# Altium schematic sheet SteeringWheel_v2.SchDoc
size A4
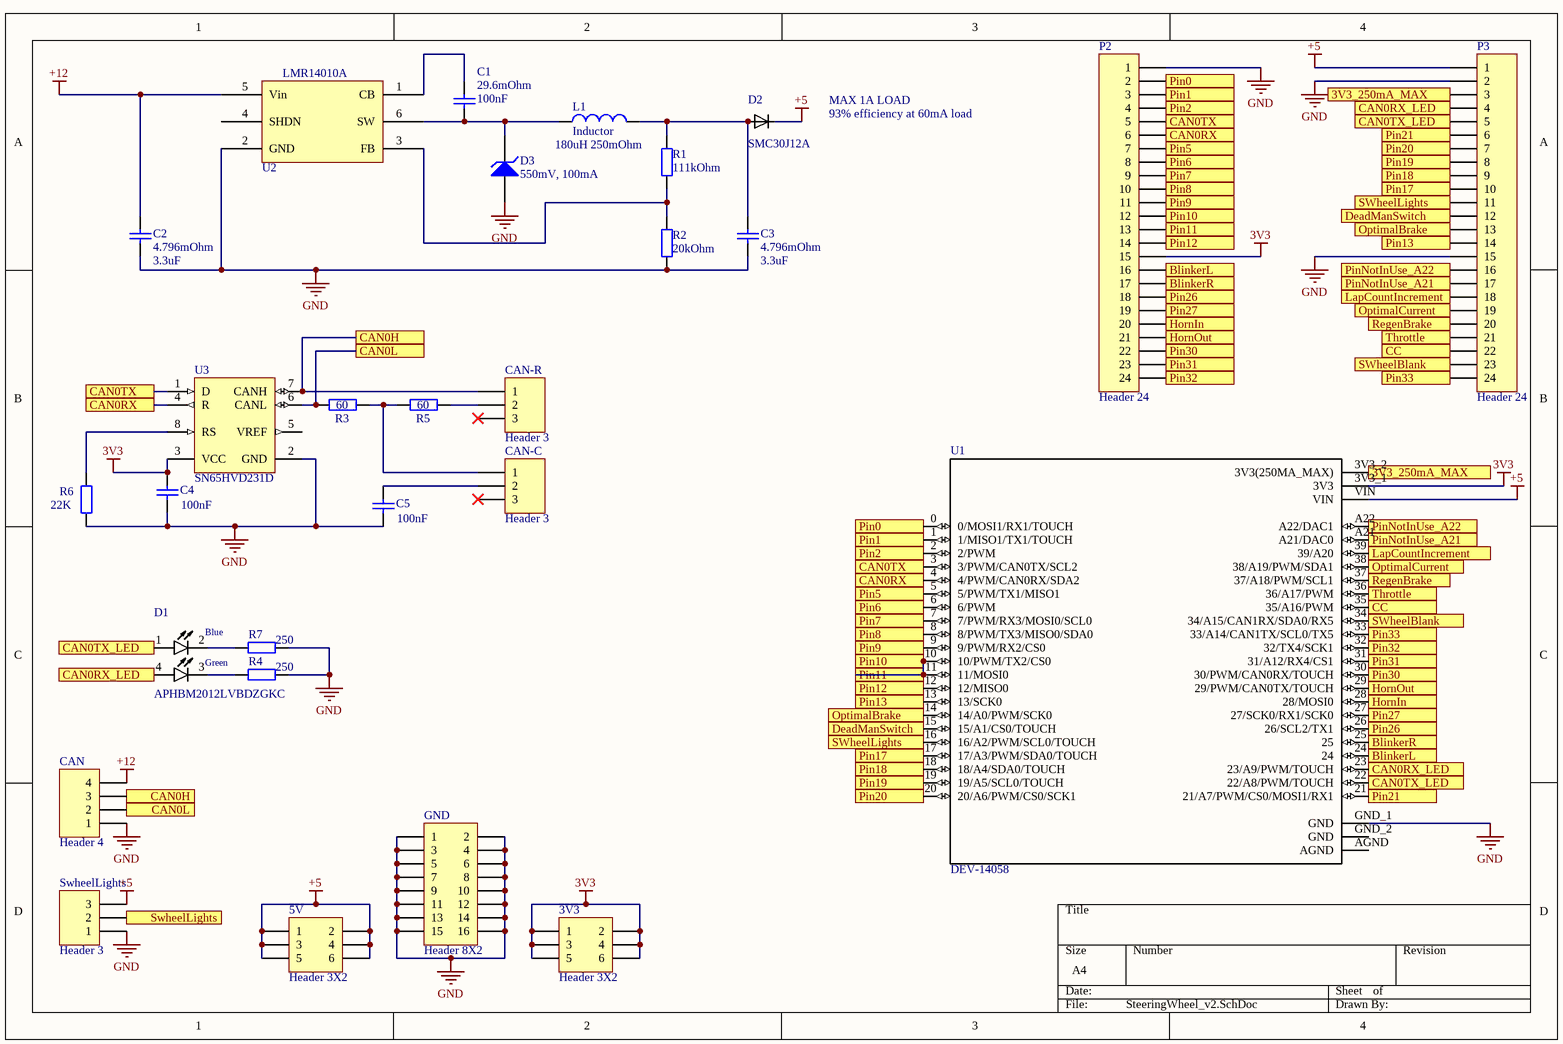
[diagram p0: SteeringWheel_v2.SchDoc]

## Parts
3V3  Header 3X2  [HDR2X3]
5V  Header 3X2  [HDR2X3]
C1  29.6mOhm  value 100nF  [1608[0603]]
C2  4.796mOhm  value 3.3uF  [1608[0603]]
C3  4.796mOhm  value 3.3uF  [1608[0603]]
C4  value 100nF  [1608[0603]]
C5  value 100nF  [1608[0603]]  (hidden comment: 4.796mOhm)
CAN  Header 4  [HDR1X4]
CAN-C  Header 3  [HDR1X3]
CAN-R  Header 3  [HDR1X3]
D1  APHBM2012LVBDZGKC  [*KINGBRIGHT_APHBM2012LVBDZGKC]
D2  SMC30J12A  [*DIOM7959X265_SMC30J12A(Primary)]
D3  550mV, 100mA  [*SOD523]
GND  Header 8X2  [HDR2X8]
L1  Inductor  value 180uH 250mOhm  [*IND_SRR1210-220M]
P2  Header 24  [HDR1X24]
P3  Header 24  [HDR1X24]
R1  value 111kOhm  [*RESC2012X60]  (hidden comment: Res2)
R2  value 20kOhm  [*RESC2012X60]  (hidden comment: Res2)
R3  value 60  [1608[0603]]  (hidden comment: Res2)
R4  value 250  [1608[0603]]  (hidden comment: Res2)
R5  value 60  [1608[0603]]  (hidden comment: Res2)
R6  value 22K  [1608[0603]]  (hidden comment: Res2)
R7  value 250  [1608[0603]]  (hidden comment: Res2)
SwheelLights  Header 3  [HDR1X3]
U1  DEV-14058  [*SPARKFUN_DEV-14058_DEV-14058(Primary)]
U2  LMR14010ADDC  [*SOT95P280X110-6N]  (value not drawn)
U3  SN65HVD231D  [*SOIC127P600X175-8N]

## Ports
3V3_250mA_MAX, BlinkerL, BlinkerR, CAN0H, CAN0L, CAN0RX, CAN0RX_LED, CAN0TX, CAN0TX_LED, CC, DeadManSwitch, HornIn, HornOut, LapCountIncrement, OptimalBrake, OptimalCurrent, Pin0, Pin1, Pin2, Pin5, Pin6, Pin7, Pin8, Pin9, Pin10, Pin11, Pin12, Pin13, Pin17, Pin18, Pin19, Pin20, Pin21, Pin26, Pin27, Pin30, Pin31, Pin32, Pin33, PinNotInUse_A21, PinNotInUse_A22, RegenBrake, SWheelBlank, SWheelLights, SwheelLights, Throttle

## Nets
3V3: 3V3.1 3V3.2 3V3.3 3V3.4 3V3.5 3V3.6 C4.2 P2.15 U1.3V3_1(3V3) U3.3(VCC)
+5: 5V.1 5V.2 5V.3 5V.4 5V.5 5V.6 D2.C P3.1 SwheelLights.3 U1.VIN
+12: C2.2 CAN.4 U2.5(Vin)
GND: C2.1 C3.1 C4.1 C5.1 CAN.1 D3.1(A) GND.1 GND.2 GND.3 GND.4 GND.5 GND.6 GND.7 GND.8 GND.9 GND.10 GND.11 GND.12 GND.13 GND.14 GND.15 GND.16 P2.1 P3.2 P3.15 R2.1 R4.2 R6.2 R7.2 SwheelLights.1 U1.GND_1(GND) U2.2(GND) U3.2(GND)
3V3_250mA_MAX: P3.3 U1.3V3_2(3V3(250MA_MAX)) ; port 3V3_250mA_MAX
BlinkerL: P2.16 U1.24 ; port BlinkerL
BlinkerR: P2.17 U1.25 ; port BlinkerR
CAN0H: CAN.3 CAN-R.1 U3.7(CANH) ; port CAN0H
CAN0L: CAN.2 R3.1 U3.6(CANL) ; port CAN0L
CAN0RX: P2.6 U1.4(4/PWM/CAN0RX/SDA2) U3.4(R) ; port CAN0RX
CAN0RX_LED: D1.4(AG) P3.4 U1.23(23/A9/PWM/TOUCH) ; port CAN0RX_LED
CAN0TX: P2.5 U1.3(3/PWM/CAN0TX/SCL2) U3.1(D) ; port CAN0TX
CAN0TX_LED: D1.1(AB) P3.5 U1.22(22/A8/PWM/TOUCH) ; port CAN0TX_LED
CC: P3.22 U1.35(35/A16/PWM) ; port CC
DeadManSwitch: P3.12 U1.15(15/A1/CS0/TOUCH) ; port DeadManSwitch
HornIn: P2.20 U1.28(28/MOSI0) ; port HornIn
HornOut: P2.21 U1.29(29/PWM/CAN0TX/TOUCH) ; port HornOut
LapCountIncrement: P3.18 U1.39(39/A20) ; port LapCountIncrement
OptimalBrake: P3.13 U1.14(14/A0/PWM/SCK0) ; port OptimalBrake
OptimalCurrent: P3.19 U1.38(38/A19/PWM/SDA1) ; port OptimalCurrent
Pin0: P2.2 U1.0(0/MOSI1/RX1/TOUCH) ; port Pin0
Pin1: P2.3 U1.1(1/MISO1/TX1/TOUCH) ; port Pin1
Pin2: P2.4 U1.2(2/PWM) ; port Pin2
Pin5: P2.7 U1.5(5/PWM/TX1/MISO1) ; port Pin5
Pin6: P2.8 U1.6(6/PWM) ; port Pin6
Pin7: P2.9 U1.7(7/PWM/RX3/MOSI0/SCL0) ; port Pin7
Pin8: P2.10 U1.8(8/PWM/TX3/MISO0/SDA0) ; port Pin8
Pin9: P2.11 U1.9(9/PWM/RX2/CS0) ; port Pin9
Pin10: P2.12 P2.13 U1.10(10/PWM/TX2/CS0) U1.11(11/MOSI0) ; port Pin10, port Pin11
Pin12: P2.14 U1.12(12/MISO0) ; port Pin12
Pin13: P3.14 U1.13(13/SCK0) ; port Pin13
Pin17: P3.10 U1.17(17/A3/PWM/SDA0/TOUCH) ; port Pin17
Pin18: P3.9 U1.18(18/A4/SDA0/TOUCH) ; port Pin18
Pin19: P3.8 U1.19(19/A5/SCL0/TOUCH) ; port Pin19
Pin20: P3.7 U1.20(20/A6/PWM/CS0/SCK1) ; port Pin20
Pin21: P3.6 U1.21(21/A7/PWM/CS0/MOSI1/RX1) ; port Pin21
Pin26: P2.18 U1.26(26/SCL2/TX1) ; port Pin26
Pin27: P2.19 U1.27(27/SCK0/RX1/SCK0) ; port Pin27
Pin30: P2.22 U1.30(30/PWM/CAN0RX/TOUCH) ; port Pin30
Pin31: P2.23 U1.31(31/A12/RX4/CS1) ; port Pin31
Pin32: P2.24 U1.32(32/TX4/SCK1) ; port Pin32
Pin33: P3.24 U1.33(33/A14/CAN1TX/SCL0/TX5) ; port Pin33
PinNotInUse_A21: P3.17 U1.A21(A21/DAC0) ; port PinNotInUse_A21
PinNotInUse_A22: P3.16 U1.A22(A22/DAC1) ; port PinNotInUse_A22
RegenBrake: P3.20 U1.37(37/A18/PWM/SCL1) ; port RegenBrake
SWheelBlank: P3.23 U1.34(34/A15/CAN1RX/SDA0/RX5) ; port SWheelBlank
SWheelLights: P3.11 SwheelLights.2 U1.16(16/A2/PWM/SCL0/TOUCH) ; port SWheelLights, port SwheelLights
Throttle: P3.21 U1.36(36/A17/PWM) ; port Throttle
NetC1_1: C1.1 D3.2(K) L1.1 U2.6(SW)
NetC1_2: C1.2 U2.1(CB)
NetC3_2: C3.2 D2.A L1.2 R1.2
NetC5_2: C5.2 CAN-C.2
NetCAN-C_1: CAN-C.1 R3.2 R5.1
NetCAN-R_2: CAN-R.2 R5.2
NetD1_2: D1.2(CB) R7.1
NetD1_3: D1.3(CG) R4.1
NetR1_1: R1.1 R2.2 U2.3(FB)
NetR6_1: R6.1 U3.8(RS)

Not connected (* = marked no-connect by the designer): CAN-C 3*; CAN-R 3*; U1 AGND GND_2(GND); U2 4(SHDN); U3 5(VREF)

## Notes on the sheet
- MAX 1A LOAD
- 93% efficiency at 60mA load
- (in symbol APHBM2012LVBDZGKC) Blue; Green
- (in symbol LMR14010ADDC) LMR14010A

## Library data of the parts
3V3 5V = Header 3X2: Header, 3-Pin, Dual row; LatestRevisionDate: 17-Jul-2002; LatestRevisionNote: Re-released for DXP Platform.; Publisher: Altium Limited
C1-C5 = Cap: Capacitor; Published: 8-Jun-2000; LatestRevisionDate: 17-Jul-2002; LatestRevisionNote: Re-released for DXP Platform.; PackageReference: RAD-0.3; Publisher: Altium Limited; PackageDescription: Radial Cap, Thru-Hole; 2 Leads; 0.3 in Pin Spacing
CAN = Header 4: Header, 4-Pin; LatestRevisionDate: 17-Jul-2002; LatestRevisionNote: Re-released for DXP Platform.; Publisher: Altium Limited
CAN-C CAN-R SwheelLights = Header 3: Header, 3-Pin; LatestRevisionDate: 17-Jul-2002; LatestRevisionNote: Re-released for DXP Platform.; Publisher: Altium Limited
D1 = APHBM2012LVBDZGKC: HELI Colour; 2.0X1.2MM LOW CURRENT BLUE/GREEN SMD LED; MF: Kingbright; Availability: Unavailable; MP: APHBM2012LVBDZGKC; SnapEDA_Link: https://www.snapeda.com/parts/APHBM2012LVBDZGKC/Kingbright/view-part/?ref=snap; Price: None; Package: 0805 Kingbright; Value: *
D2 = SMC30J12A: Transient Voltage Suppressor, TVS, Transil SMC30J Series, Unidirectional, 12 V, DO-214AB, 2; MF: STMicroelectronics; Price: None; Package: DO-214 STMicroelectronics; Availability: Unavailable; MP: SMC30J12A; SnapEDA_Link: https://www.snapeda.com/parts/SMC30J12A/STMicroelectronics/view-part/?ref=snap; Value: *
D3 = D Zener: Zener Diode; Published: 8-Jun-2000; LatestRevisionDate: 17-Jul-2002; LatestRevisionNote: Re-released for DXP Platform.; PackageReference: DIODE-0.7; Publisher: Altium Limited; PackageDescription: Diode, Thru-Hole; 2 Leads; 0.7 in Pin Spacing
GND = Header 8X2: Header, 8-Pin, Dual row; LatestRevisionDate: 17-Jul-2002; LatestRevisionNote: Re-released for DXP Platform.; Publisher: Altium Limited
L1 = Inductor: Code_IEC: 1005; Published: 8-Jun-2000; LatestRevisionDate: 29-May-2009; LatestRevisionNote: IPC-7351 Footprint Added.; PackageReference: 0402-A; Publisher: Altium Limited; PackageDescription: Chip Inductor; Code_JEITA: 0402
P2 P3 = Header 24: Header, 24-Pin; LatestRevisionDate: 17-Jul-2002; LatestRevisionNote: Re-released for DXP Platform.; Publisher: Altium Limited
R1-R7 = Res2: Resistor; Published: 8-Jun-2000; LatestRevisionDate: 17-Jul-2002; LatestRevisionNote: Re-released for DXP Platform.; PackageReference: AXIAL-0.4; Publisher: Altium Limited; PackageDescription: Axial Device, Thru-Hole; 2 Leads; 0.4 in Pin Spacing
U1 = DEV-14058: Teensy 3.6 _Headers_; MF: SparkFun Electronics; Digi-Key_Part_Number: 1568-1465-ND; Package: None; SnapEDA_Link: https://www.snapeda.com/parts/DEV-14058/SparkFun%20Electronics/view-part/?ref=snap; Digi-Key_Purchase_URL: https://www.digikey.no/product-detail/en/sparkfun-electronics/DEV-14058/1568-1465-ND/6569369?utm_source=snapeda&utm_medium=aggregator&utm_campaign=symbol; MP: DEV-14058; Value: *
U3 = SN65HVD231D: 3.3V CAN Transceiver with Sleep Mode, 17 mA, 3.3 V, -40 to 85 degC, 8-pin SOIC (D), Green (RoHS & no Sb/Br); Manufacturer: Texas Instruments; Drivers Per Package: 1; Transient Pulse Protection(V): -25 to 25; ICC(Max)(mA): 17; Supply Voltage(s)(V): 3.3; Rating: Catalog; DatasheetVersion: SLOS346K; PackageVersion: revM, Jun-2011; PackageReference: D8; PackageDescription: 8-Pin Plastic Small Outline Integrated Circuit, 4.9 x 3.9 mm, Pitch 1.27 mm Pitch; Supplier 1: Digi-Key; Supplier Part Number 1: 296-12206-5-ND; Supplier 2: Farnell; Supplier Part Number 2: 1106059; Supplier 3: Newark; Supplier Part Number 3: 75C7748; Supplier 4: Mouser; Supplier Part Number 4: 595-SN65HVD231D; Eco-Plan: Green (RoHS & no Sb/Br); SubFamily: CAN; Receivers Per Package: 1; Isolated: No; Features: Bus Wake Up; Low Power Mode: Sleep; Footprint: PCA82C250; Mounting Technology: Surface Mount; PartNumber: SN65HVD231D; Code_JEDEC: MS-012AA; ComponentLink1Description: Datasheet; ComponentLink1URL: http://www.ti.com/general/docs/lit/getliterature.tsp?genericPartNumber=SN65HVD231&fileType=pdf